# EAGLE design SolarRS485 (EAGLE 7.4.0)
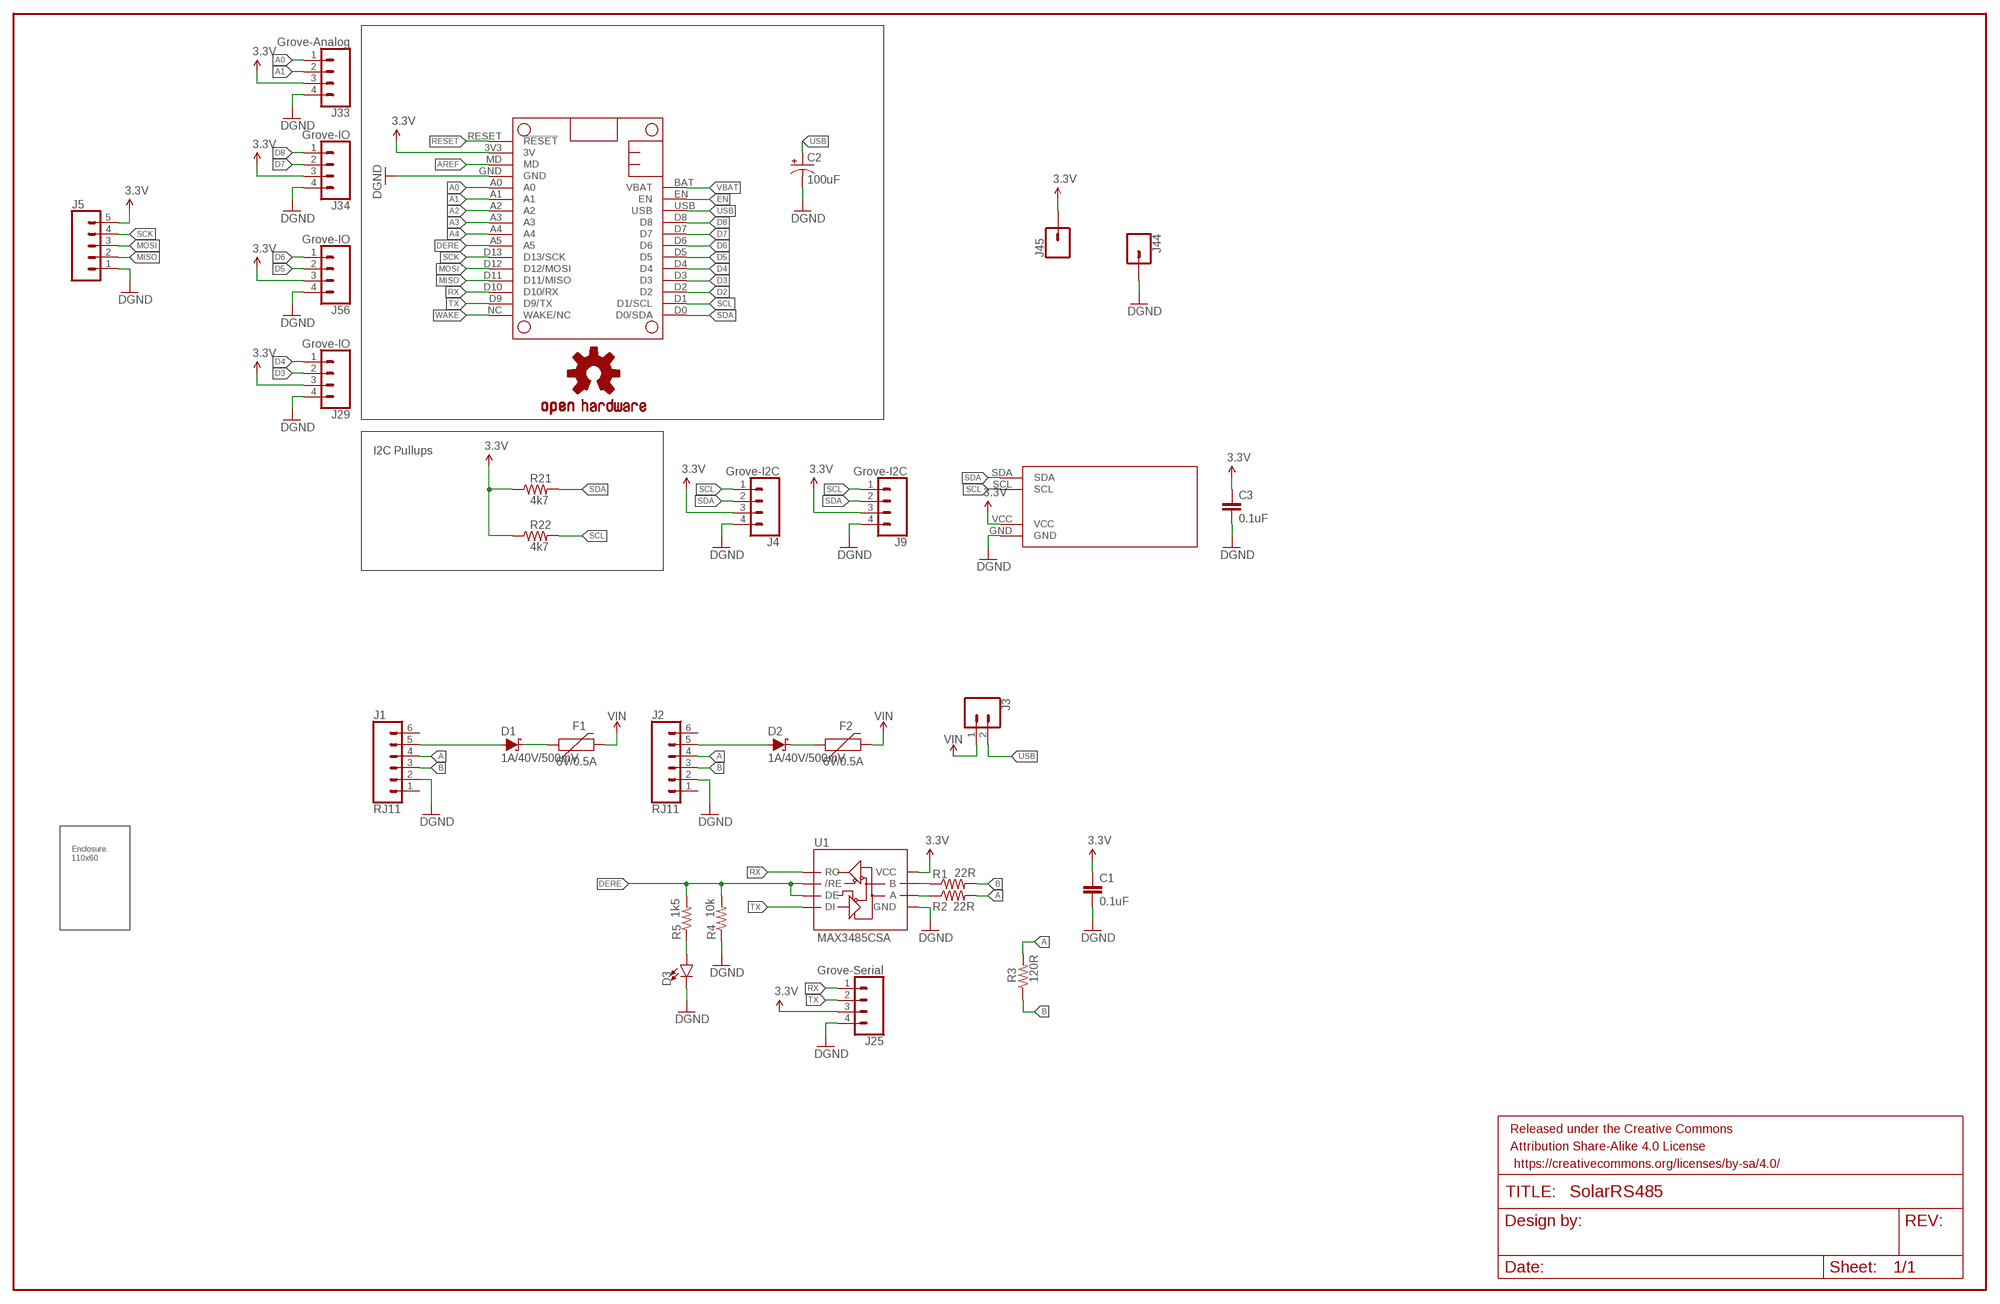
[diagram p0: schematic, sheet 1]

## Parts
C1  0.1uF  0.1UF-0805-25V  [0805]
C2  100uF  100UF-POLAR-RADIAL-2.5MM-25V-20%  [CPOL-RADIAL-2.5MM-6.5MM]
C3  0.1uF  0.1UF-0805-25V  [0805]
D1  1A/40V/500mV  DIODE-SCHOTTKY-SS14  [SMA-DIODE]
D2  1A/40V/500mV  DIODE-SCHOTTKY-SS14  [SMA-DIODE]
D3  LEDLED-1206-BOTTOM-2.0MM-BLUE  [LED-1206-BOTTOM-2.0MM]
F1  6V/0.5A  PPTC_HALF-AMP  [1206]
F2  6V/0.5A  PPTC_HALF-AMP  [1206]
FRAME2  FRAME-LEDGER  [CREATIVE_COMMONS]
J1  RJ11  RJ11-6  [RJ11-6]
J2  RJ11  RJ11-6  [RJ11-6]
J3  CONN_02  [1X02]
J4  Grove-I2C  CONN_04GROVE-JST-PH-4-2MM  [JST-4-PH-GROVE]
J5  CONN_05  [1X05]
J9  Grove-I2C  CONN_04GROVE-JST-PH-4-2MM  [JST-4-PH-GROVE]
J25  Grove-Serial  CONN_04GROVE-JST-PH-4-2MM  [JST-4-PH-GROVE]
J29  Grove-IO  CONN_04GROVE-JST-PH-4-2MM  [JST-4-PH-GROVE]
J33  Grove-Analog  CONN_04GROVE-JST-PH-4-2MM  [JST-4-PH-GROVE]
J34  Grove-IO  CONN_04GROVE-JST-PH-4-2MM  [JST-4-PH-GROVE]
J44  CONN_01PTH_NO_SILK_YES_STOP  [1X01_NO_SILK]
J45  CONN_01PTH_NO_SILK_YES_STOP  [1X01_NO_SILK]
J56  Grove-IO  CONN_04GROVE-JST-PH-4-2MM  [JST-4-PH-GROVE]
LOGO1  OSHW-LOGOM  [OSHW-LOGO-M]
MS1  XENONA  [XENON_BREAKOUT_A]
R1  22R  RESISTOR0805  [0805]
R2  22R  RESISTOR0805  [0805]
R3  120R  RESISTOR0805  [0805]
R4  10k  RESISTOR0805  [0805]
R5  1k5  RESISTOR0805  [0805]
R21  4k7  RESISTOR0805  [0805]
R22  4k7  RESISTOR0805  [0805]
U1  MAX3485CSA  RS485SOIC  [SO08]
U$1  CAMDENBOSS-ENCLOSURE-110X60BOTH-EXTENDED-WIDE  [CAMDENBOSS_ENCLOSURE_110X60_WIDE_EXTENDED]
U$2  DISPLAY0.96_INCH_DISPLAY  [I2C_DISPLAY_0.96_INCH]

## Nets
3.3V: C1.1 C3.1 J4.3 J5.5 J9.3 J25.3 J29.3 J33.3 J34.3 J45.1 J56.3 MS1.3V3(3V) R21.1 R22.1 U1.8(VCC) U$2.VCC
A: J1.4 J2.4 R2.2 R3.2
A0: J33.1 MS1.A0
A1: J33.2 MS1.A1
A2: MS1.A2
A3: MS1.A3
A4: MS1.A4
AREF: MS1.MD
B: J1.3 J2.3 R1.2 R3.1
D2: MS1.D2
D3: J29.2 MS1.D3
D4: J29.1 MS1.D4
D5: J56.2 MS1.D5
D6: J56.1 MS1.D6
D7: J34.2 MS1.D7
D8: J34.1 MS1.D8
DERE: MS1.A5 R4.2 R5.2 U1.2(/RE) U1.3(DE)
EN: MS1.EN
GND: C1.2 C2.2(-) C3.2 D3.C J1.2 J2.2 J4.4 J5.1 J9.4 J25.4 J29.4 J33.4 J34.4 J44.1 J56.4 MS1.GND R4.1 U1.5(GND) U$2.GND ; supply symbol labelled DGND
MISO: J5.2 MS1.D11(D11/MISO)
MOSI: J5.3 MS1.D12(D12/MOSI)
N$1: D2.A J2.5
N$3: D1.A J1.5
N$7: D2.C F2.1
N$11: D1.C F1.1
N$12: R1.1 U1.7(B)
N$13: R2.1 U1.6(A)
N$21: D3.A R5.1
RESET: MS1.RESET(!RESET)
RX: J25.1 MS1.D10(D10/RX) U1.1(RO)
SCK: J5.4 MS1.D13(D13/SCK)
SCL: J4.1 J9.1 MS1.D1(D1/SCL) R22.2 U$2.SCL
SDA: J4.2 J9.2 MS1.D0(D0/SDA) R21.2 U$2.SDA
TX: J25.2 MS1.D9(D9/TX) U1.4(DI)
USB: C2.1(+) J3.2 MS1.USB
VBAT: MS1.BAT(VBAT)
VIN: F1.2 F2.2 J3.1
WAKE: MS1.NC(WAKE/NC)
Unconnected: J1.1 J1.6 J2.1 J2.6

## Notes on the sheet
- I2C Pullups

## Library data of the parts
C1 C3 = ThingySticks:0.1UF: 0.1µF ceramic capacitors A capacitor is a passive two-terminal electrical component used to store electrical energy temporarily in an electric field.
C2 = SparkFun-Capacitors:100UF-POLAR: 100µF polarized capacitors A capacitor is a passive two-terminal electrical component used to store electrical energy temporarily in an electric field.; PROD_ID: CAP-08439
D1 D2 = SparkFun-DiscreteSemi:DIODE-SCHOTTKY: Schottky diode A Schottky diode is a semiconductor diode which has a low forward voltage drop and a very fast switching action.; PROD_ID: DIO-08053
D3 = ThingySticks:LED: LED (Generic) Standard schematic elements and footprints for 5mm, 3mm, 1206, and 0603 sized LEDs. Generic LEDs with no color specified.; COLOR: Blue; FARNELL: 2217907; FORWARD_VOLTAGE: 3.3
F1 F2 = SparkFun-Fuses:PPTC: Resettable Fuse PPTC Resettable Fuse. Really a sort of resistor with a polymeric positive temperature coefficient whose resistance increases dramatically with an increase in temperature. When heated by the power passing through the resistance rises causing the current to be limited, protecting the circuit. This is achieved by the transition of the polymer from a crystalline to an amorphous state where the conductive carbon separates breaking the conductive pathways found in the cool crystalline structure. When a PPTC cools back down it resumes conducting letting the circuit turn back on. SparkFun Products: SparkFun RedBoard - Programmed with Arduino <https://www.sparkfun.com/products/12757> Pro Micro - 5V/16MHz <https://www.sparkfun.com/products/12640> Arduino Pro 328 - 5V/16MHz <https://www.sparkfun.com/products/10915> MP3 Trigger <https://www.sparkfun.com/products/13720>; PROD_ID: RES-08585
FRAME2 = SparkFun-Aesthetics:FRAME-LEDGER: Schematic Frame Standard 11x14 US Ledger frame
J1 J2 = SparkFun-Connectors:RJ11-6: RJ11 Jack - 6 pin Commonly found on CAT3 devices and some Microchip programmers. Here is the connector we sell at SparkFun: RJ11 6-Pin Connector <https://www.sparkfun.com/products/132> (PRT-00132) Datasheet <http://www.sparkfun.com/datasheets/Prototyping/Connectors/RJ11-Datasheet.pdf> It is used on this SparkFun product: SparkFun Weather Shield <https://www.sparkfun.com/products/12081> (DEV-12081) Weather Meters <https://www.sparkfun.com/products/8942> (SEN-08942); PROD_ID: CONN-08590; SF_ID: PRT-00132
J3 = ThingySticks:CONN_02: Multi connection point. Often used as Generic Header-pin footprint for 0.1 inch spaced/style header connections On any of the 0.1 inch spaced packages, you can populate with these: Break Away Headers - Straight <https://www.sparkfun.com/products/116> (PRT-00116) Break Away Male Headers - Right Angle <https://www.sparkfun.com/products/553> (PRT-00553) Female Headers <https://www.sparkfun.com/products/115> (PRT-00115) Break Away Headers - Machine Pin <https://www.sparkfun.com/products/117> (PRT-00117) Break Away Female Headers - Swiss Machine Pin <https://www.sparkfun.com/products/743> (PRT-00743) For SCREWTERMINALS and SPRING TERMINALS visit here: Screw Terimnals on SparkFun.com <https://www.sparkfun.com/search/results?term=Screw+Terminals> (5mm/3.5mm/2.54mm spacing) This device is also useful as a general connection point to wire up your design to another part of your project. Our various solder wires solder well into these plated through hole pads. Hook-Up Wire - Assortment (Stranded, 22 AWG) <https://www.sparkfun.com/products/11375> (PRT-11375) Hook-Up Wire - Assortment (Solid Core, 22 AWG) <https://www.sparkfun.com/products/11367> (PRT-11367) View the entire wire category on our website here <https://www.sparkfun.com/categories/141> Special notes: Molex polarized connector foot print use with: PRT-08233 with associated crimp pins and housings. 2.54_SCREWTERM for use with PRT-10571. 3.5mm Screw Terminal footprints for PRT-08084 5mm Screw Terminal footprints for use with PRT-08432
J4 J9 J25 J29 J33 J34 J56 = ThingySticks:CONN_04: Multi connection point. Often used as Generic Header-pin footprint for 0.1 inch spaced/style header connections On any of the 0.1 inch spaced packages, you can populate with these: Break Away Headers - Straight <https://www.sparkfun.com/products/116> (PRT-00116) Break Away Male Headers - Right Angle <https://www.sparkfun.com/products/553> (PRT-00553) Female Headers <https://www.sparkfun.com/products/115> (PRT-00115) Break Away Headers - Machine Pin <https://www.sparkfun.com/products/117> (PRT-00117) Break Away Female Headers - Swiss Machine Pin <https://www.sparkfun.com/products/743> (PRT-00743) For SCREWTERMINALS and SPRING TERMINALS visit here: Screw Terimnals on SparkFun.com <https://www.sparkfun.com/search/results?term=Screw+Terminals> (5mm/3.5mm/2.54mm spacing) This device is also useful as a general connection point to wire up your design to another part of your project. Our various solder wires solder well into these plated through hole pads. Hook-Up Wire - Assortment (Stranded, 22 AWG) <https://www.sparkfun.com/products/11375> (PRT-11375) Hook-Up Wire - Assortment (Solid Core, 22 AWG) <https://www.sparkfun.com/products/11367> (PRT-11367) View the entire wire category on our website here <https://www.sparkfun.com/categories/141> Special notes: Molex polarized connector foot print use with SKU : PRT-08231 with associated crimp pins and housings. 1MM SMD Version SKU: PRT-10208
J5 = SparkFun-Connectors:CONN_05: Multi connection point. Often used as Generic Header-pin footprint for 0.1 inch spaced/style header connections On any of the 0.1 inch spaced packages, you can populate with these: Break Away Headers - Straight <https://www.sparkfun.com/products/116> (PRT-00116) Break Away Male Headers - Right Angle <https://www.sparkfun.com/products/553> (PRT-00553) Female Headers <https://www.sparkfun.com/products/115> (PRT-00115) Break Away Headers - Machine Pin <https://www.sparkfun.com/products/117> (PRT-00117) Break Away Female Headers - Swiss Machine Pin <https://www.sparkfun.com/products/743> (PRT-00743) For SCREWTERMINALS and SPRING TERMINALS visit here: Screw Terimnals on SparkFun.com <https://www.sparkfun.com/search/results?term=Screw+Terminals> (5mm/3.5mm/2.54mm spacing) This device is also useful as a general connection point to wire up your design to another part of your project. Our various solder wires solder well into these plated through hole pads. Hook-Up Wire - Assortment (Stranded, 22 AWG) <https://www.sparkfun.com/products/11375> (PRT-11375) Hook-Up Wire - Assortment (Solid Core, 22 AWG) <https://www.sparkfun.com/products/11367> (PRT-11367) View the entire wire category on our website here <https://www.sparkfun.com/categories/141> Special notes: Molex polarized connector foot print use with SKU : PRT-08231 with associated crimp pins and housings. 1MM SMD Version SKU: PRT-10208
J44 J45 = SparkFun-Connectors:CONN_01: Single connection point. Often used as Generic Header-pin footprint for 0.1 inch spaced/style header connections On any of the 0.1 inch spaced packages, you can populate with these: Break Away Headers - Straight <https://www.sparkfun.com/products/116> (PRT-00116) Break Away Male Headers - Right Angle <https://www.sparkfun.com/products/553> (PRT-00553) Female Headers <https://www.sparkfun.com/products/115> (PRT-00115) Break Away Headers - Machine Pin <https://www.sparkfun.com/products/117> (PRT-00117) Break Away Female Headers - Swiss Machine Pin <https://www.sparkfun.com/products/743> (PRT-00743) This device is also useful as a general connection point to wire up your design to another part of your project. Our various solder wires solder well into these plated through hole pads. Hook-Up Wire - Assortment (Stranded, 22 AWG) <https://www.sparkfun.com/products/11375> (PRT-11375) Hook-Up Wire - Assortment (Solid Core, 22 AWG) <https://www.sparkfun.com/products/11367> (PRT-11367) View the entire wire category on our website here <https://www.sparkfun.com/categories/141> Special notes: SMTSO-256-ET is a "flush mount" nut for a 4-40 screw. We mostly use this on specialty testbeds; it is a nice way to connect hardware to your PCB at an adjustable hieght. Also note, the SNAP packages are for using a snappable style connector. We sell a baggie of snaps and they are also used on two LilyPad designs: Snap Assortment - 30 pack (male and female) <https://www.sparkfun.com/products/11347> (DEV-11347) LilyPad Arduino SimpleSnap <https://www.sparkfun.com/products/10941> (DEV-10941) LilyPad SimpleSnap Protoboard <https://www.sparkfun.com/products/10940> (DEV-10940)
LOGO1 = SparkFun-Aesthetics:OSHW-LOGO: Open Source Hardware Logo This logo indicates the piece of hardware it is found on incorporates a OSHW license and/or adheres to the definition of open source hardware found here: http://freedomdefined.org/OSHW
MS1 = ThingySticks:XENON
R1-R5 R21 R22 = SparkFun-Resistors:RESISTOR: Generic Resistor Package
U1 = SparkFun-IC-Comms:RS485: RS-485 Transceiver SP3485 Series 8 Pin NSOIC 3.3 V Low Power Half Duplex RS-485 Transceiver MAX3485 compatible Datasheet <http://www.sparkfun.com/datasheets/Components/General/sp3485CN-LTR.pdf> SparkFun Products SparkFun Transceiver Breakout - RS-485 <https://www.sparkfun.com/products/10124> (BOB-10124) SparkFun USB to RS-485 Converter <https://www.sparkfun.com/products/9822> (BOB-09822); PROD_ID: IC-09388
U$1 = ThingySticks:CAMDENBOSS-ENCLOSURE-110X60
U$2 = ThingySticks:DISPLAY

## Board
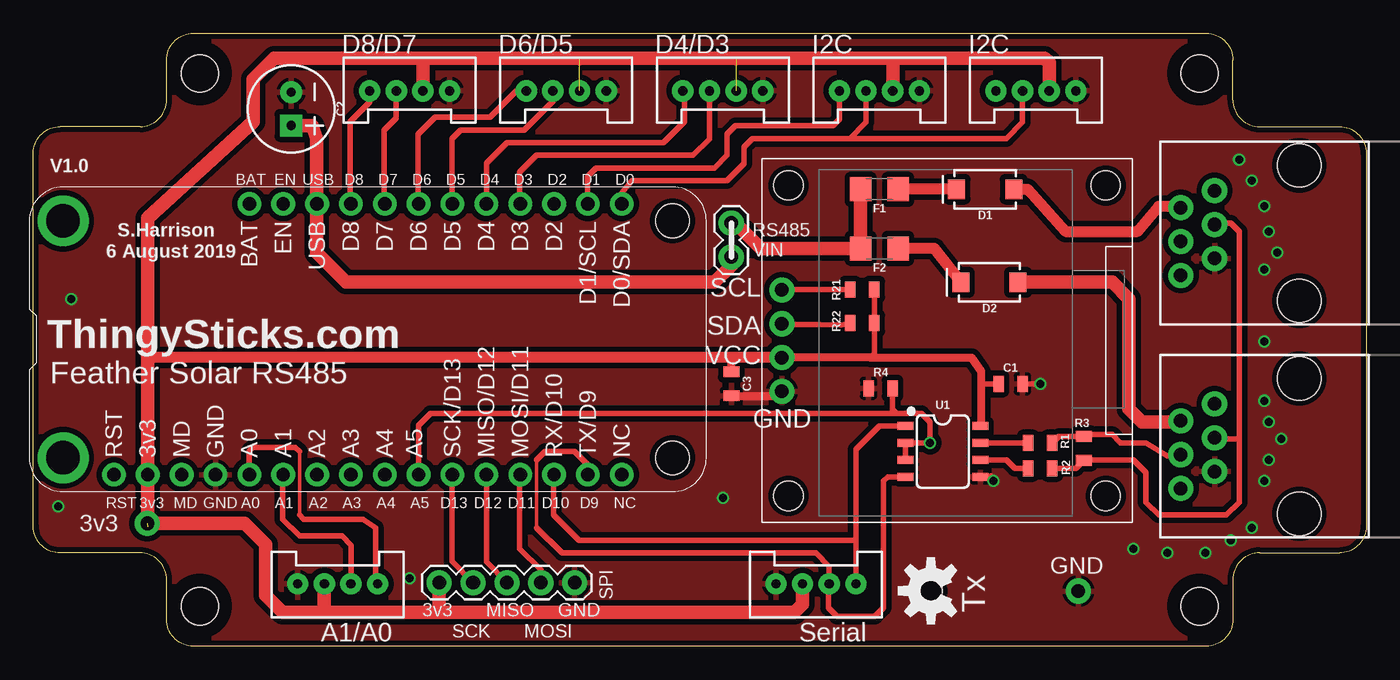
[diagram p1: board, top side]
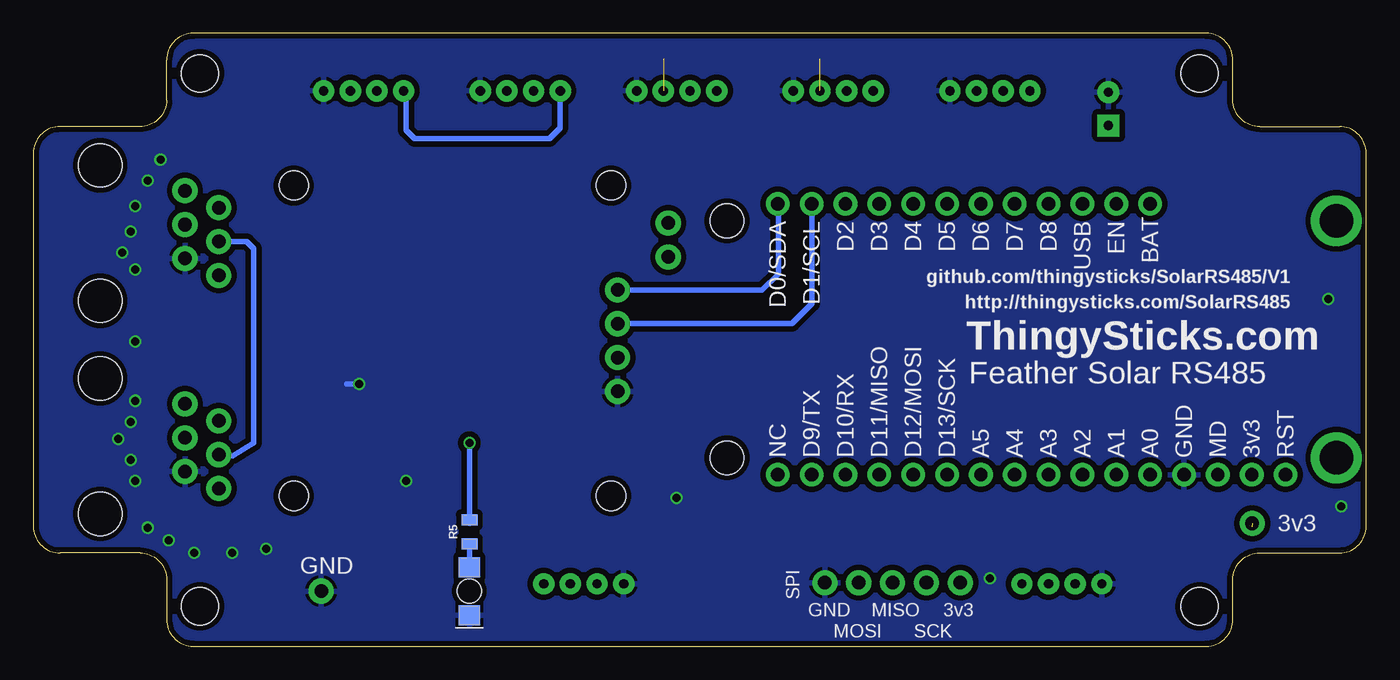
[diagram p2: board, bottom side, seen from below]

Size 100 x 46 mm. Coordinates in mm from the lower left corner, seen from the top.
Copper layers (1*16): Top 0.035mm / dielectric 1.5mm / Bottom 0.035mm
Design rules "dirt_cheap_dirty_boards.v1.1": minimum track width 6mil, minimum drill 12mil, track to track 6mil, track to pad 6mil, pad to pad 6mil, via to via 6mil, smd to smd 0mil, copper to edge 10mil, drill to drill 10mil, minimum pad ring 10mil, minimum via ring 6mil, stop-mask expansion 2mil, vias tented up to drill 25mil, thermal gap 10mil
tRestrict: area 10.5,41 to 14.5,45; area 10.5,1 to 14.5,5; area 85.5,1 to 89.5,5; area 85.5,41 to 89.5,45

### Footprints (pad centres in the part's own frame; a part is rotated, then mirrored left to right if it is on the bottom)
0805 = smd 0.8 x 1.2: 1 -0.9,0; 2 0.9,0
CPOL-RADIAL-2.5MM-6.5MM = drill 0.7 pad 1.651 square: 1 1.25,0 | drill 0.7 pad 1.651: 2 -1.25,0
SMA-DIODE = smd 1.27 x 1.47: A -2.15,0; C 2.15,0
LED-1206-BOTTOM-2.0MM = smd 1.5 x 1.6: A -1.8,0; C 1.8,0 | hole 1.8: 0,0
1206 = smd 1.6 x 1.8: 1 -1.4,0; 2 1.4,0
RJ11-6 = drill 1.016 pad 1.88: 1 -3.175,8.89; 2 -1.905,6.35; 3 -0.635,8.89; 4 0.635,6.35; 5 1.905,8.89; 6 3.175,6.35 | hole 3.251: -5.08,0; 5.08,0
1X02 = drill 1.016 pad 1.88: 1 0,0; 2 2.54,0
JST-4-PH-GROVE = drill 0.7 pad 1.6: 1 -3,-0.55; 2 -1,-0.55; 3 1,-0.55; 4 3,-0.55
1X05 = drill 1.016 pad 1.88: 1 0,0; 2 2.54,0; 3 5.08,0; 4 7.62,0; 5 10.16,0
1X01_NO_SILK = drill 1.016 pad 1.88: 1 0,0
XENON_BREAKOUT_A = drill 1 pad 1.778: 3V3 8.89,1.27; A0 16.51,1.27; A1 19.05,1.27; A2 21.59,1.27; A3 24.13,1.27; A4 26.67,1.27; A5 29.21,1.27; BAT 16.51,21.59; D0 44.45,21.59; D1 41.91,21.59; D2 39.37,21.59; D3 36.83,21.59; D4 34.29,21.59; D5 31.75,21.59; D6 29.21,21.59; D7 26.67,21.59; D8 24.13,21.59; D9 41.91,1.27; D10 39.37,1.27; D11 36.83,1.27; D12 34.29,1.27; D13 31.75,1.27; EN 19.05,21.59; GND 13.97,1.27; MD 11.43,1.27; NC 44.45,1.27; RESET 6.35,1.27; USB 21.59,21.59 | drill 2.5 pad 3.81: P$1 2.54,20.32; P$2 2.54,2.54 | hole 2.54: 48.26,20.32; 48.26,2.54
SO08 = smd 0.6 x 1.2: 1 -1.905,-2.8; 2 -0.635,-2.8; 3 0.635,-2.8; 4 1.905,-2.8; 5 1.905,2.8; 6 0.635,2.8; 7 -0.635,2.8; 8 -1.905,2.8
CAMDENBOSS_ENCLOSURE_110X60_WIDE_EXTENDED = hole 2.8: 43,2.5; 43,77.5; 3,77.5; 3,2.5
I2C_DISPLAY_0.96_INCH = drill 1.016 pad 1.88: GND 9.84,26.3; SCL 14.92,26.3; SDA 17.46,26.3; VCC 12.38,26.3 | hole 2.2: 2,25.8; 25.3,25.8; 2,2; 25.3,2

### Placement (x,y rotation side)
C1  73.32,19.7 0 top
C2  19.34,40.33 270 top
C3  52.36,19.7 270 top
D1  71.41,34.3 180 top
D2  71.73,27.32 180 top
D3  67.28,4.14 270 bottom
F1  63.47,34.3 180 top
F2  63.47,29.86 180 top
FRAME2  16.52,-14.12 0 top  (outside the outline)
J1  94.97,31.01 90 top
J2  94.97,15.01 90 top
J3  52.36,31.76 270 top
J4  63.47,42.24 0 top
J5  40.61,4.77 180 top
J9  75.22,42.24 0 top
J25  58.71,4.14 180 top
J29  51.73,42.24 0 top
J33  22.83,4.14 180 top
J34  28.23,42.24 0 top
J44  78.4,4.14 0 top
J45  8.55,9.22 0 top
J56  39.98,42.24 0 top
LOGO1  67.34,4.16 90 top
MS1  -0.3,11.6 0 top
R1  75.54,15.25 0 top
R2  75.54,13.35 0 top
R3  78.83,14.84 270 top
R4  63.56,19.35 0 top
R5  67.28,8.58 90 bottom
R21  62.19,26.77 180 top
R22  62.19,24.25 180 top
U1  68.24,14.62 270 top
U$1  90,0 90 top
U$2  82.46,9.28 90 top

### Tracks (layer width: path | path; a pad name or v marks a point on that pad's centre or on a via)
3.3V  (3 unrouted)
  Top 0.406: R21.1 R22.1 63.09,21.91 62.84,21.66 | C1.1 71.09,19.7
  Top 0.61: U1.8 71.09,16.58 71.09,19.7 71.09,20.65 70.4,21.66 62.84,21.66 U$2.VCC | C3.1 52.36,21.66
  Top 0.813: U$2.VCC 52.36,21.66 8.84,21.66 8.59,21.92
  Top 1.016: 8.59,8.94 MS1.3V3 8.59,21.92 8.59,32.12 16.48,39.38 16.48,42.55 18.07,44.14 29.5,44.14 | J9.3 76.22,43.78 75.86,44.14 64.43,44.14 | 64.43,44.14 52.68,44.14 | 52.68,44.14 40.93,44.14 | 40.93,44.14 29.5,44.14 | J34.3 29.23,43.87 29.5,44.14 | 40.98,44.09 40.93,44.14 | 52.73,44.09 52.68,44.14 | J4.3 64.47,44.09 64.43,44.14 | J25.3 57.71,3.14 57.12,2.55 30.45,2.55 | 30.45,2.55 21.88,2.55 | 21.88,2.55 18.71,2.55 17.44,3.82 17.44,7.63 15.85,9.22 J45.1 | J33.3 21.83,2.6 21.88,2.55 | J5.5 30.45,2.55
A
  Top 0.406: 90.46,15.57 90.46,31.12 89.83,31.76 88.74,31.76 J1.4 | 90.46,15.57 88.68,15.57 J2.4 | 90.46,15.57 90.46,10.8 89.51,9.85 84.43,9.85 83.48,10.8 83.48,13.03 82.52,13.98 78.87,13.98 R3.2 78.23,13.35 R2.2
A0
  Top 0.254: 19.98,14.62 19.98,9.85
  Top 0.406: MS1.A0 16.21,14.65 16.48,14.93 19.66,14.93 19.98,14.62 | 19.98,9.85 20.29,9.54 24.74,9.54 25.69,8.9 25.69,4.19 J33.1
A1
  Top 0.406: J33.2 23.83,7.58 23.15,8.27 19.98,8.27 18.71,9.54 18.71,12.83 MS1.A1
AREF
  Bottom 0.61: 11.09,12.83 MS1.MD
B
  Top 0.406: J2.3 85.67,14.3 85.06,14.3 83.48,15.25 81.57,15.25 80.94,15.88 78.97,15.88 R3.1 76.93,15.74 R1.2
  Bottom 0.406: J1.3 84,30.38 83.48,29.86 83.48,15.25 85.03,14.3 J2.3
D3
  Top 0.406: J29.2 50.73,38.06 49.5,36.84 37.76,36.84 36.49,35.57 36.49,33.23 MS1.D3
D4
  Top 0.406: MS1.D4 33.99,36.24 35.53,37.79 47.28,37.79 48.87,39.38 48.87,41.54 J29.1
D5
  Top 0.406: J56.2 38.98,40.92 36.8,38.74 32.04,38.74 31.41,38.11 31.41,33.23 MS1.D5
D6
  Top 0.406: J56.1 36.25,41.69 34.26,39.7 30.14,39.7 28.87,38.43 28.87,33.23 MS1.D6
D7
  Top 0.406: J34.2 27.23,39.65 26.33,38.74 26.33,33.23 MS1.D7
D8
  Top 0.406: J34.1 25.23,40.82 23.79,39.38 23.79,33.23 MS1.D8
DERE  (via drill 0.6)
  Top 0.406: U1.3 U1.2 v67.28,15.25 67.28,16.84 66.65,17.47 64.74,17.47 | MS1.A5 28.91,16.56 29.82,17.47 64.74,17.47 | R4.2 64.46,17.75 64.74,17.47
  Bottom 0.406: 67.28,9.22 R5.2 v67.28,15.25
GND  (via drill 0.6)
  Top 0.406: C1.2 v75.54,19.7 | U1.5 71.85,12.77 v72.05,12.39
  Top 0.61: C3.2 55.84,18.8 U$2.GND
  Bottom 0.406: v75.54,19.7 76.49,19.7
  other vias: 2.83,26.05 1.88,10.49 51.73,11.12 92.68,16.84 93.64,15.57 92.68,13.98 92.37,12.39 92.37,28.27 93.32,29.54 92.68,31.12 92.37,33.03 91.41,34.93 90.46,36.52 92.37,18.43 92.37,22.87 91.41,8.9 89.83,7.95 87.92,7 85.06,7 82.52,7.31 28.23,5.09
  pour Bottom (isolate 0.406, rank 5): -0.66,46.36 101.26,46.36 101.26,-1.26 -0.66,-1.26
  pour Top (isolate 0.406, rank 5): -0.66,46.68 100.62,46.68 100.62,-0.94 -4.15,-0.94 -4.15,46.68 -2.25,46.68
MISO
  Top 0.406: J5.2 38.07,5.72 36.49,7.31 36.49,12.83 MS1.D11
MOSI
  Top 0.406: MS1.D12 33.99,6.32 J5.3
N$1
  Top 1.016: D2.A 80.94,27.32 82.21,26.05 82.21,17.79 83.16,16.84 85.19,16.84 J2.5
N$3
  Top 0.813: D1.A 74.59,34.3 77.44,31.12 82.84,31.12 84.43,33.03 85.63,33.03 J1.5
N$7
  Top 0.813: D2.C 67.6,29.86 F2.1
N$11
  Top 0.813: D1.C F1.1
N$12
  Top 0.406: U1.7 R1.1
N$13
  Top 0.406: U1.6 73,13.98 73.63,13.35 R2.1
N$21
  Bottom 0.406: D3.A R5.1
RX
  Top 0.406: U1.1 63.47,16.52 61.71,14.76 61.71,7.95 | 61.71,7.95 40.93,7.95 39.03,9.85 39.03,12.83 MS1.D10 | J25.1 61.71,7.95
SCK
  Top 0.406: J5.4 31.41,6.36 31.41,12.83 MS1.D13
SCL
  Top 0.406: R22.2 60.58,24.1 59.03,24.14 56.22,24.14 U$2.SCL | J4.1 60.47,39.55 59.98,39.06 52.68,39.06 52.04,38.43 52.04,36.84 51.09,35.89 42.2,35.89 41.57,35.25 41.57,33.23 MS1.D1
  Bottom 0.406: U$2.SCL 43.09,24.2 41.57,25.73 41.57,33.15 MS1.D1 | J4.1 60.47,38.89 61.25,38.11 71.41,38.11 72.05,38.74 72.05,41.51 J9.1
SDA
  Top 0.406: R21.2 56.19,26.77 U$2.SDA | J4.2 62.47,39.33 61.25,38.11 | 61.25,38.11 60.62,38.11 53.95,38.11 53.31,37.48 53.31,36.2 52.04,34.93 44.94,34.93 44.11,33.98 44.11,33.19 MS1.D0 | J9.2 74.22,39.33 73,38.11 61.25,38.11
  Bottom 0.406: MS1.D0 44.11,33.15 44.11,27.95 45.32,26.74 U$2.SDA
TX
  Top 0.254: 37.76,8.9 37.76,13.98
  Top 0.406: U1.4 64.11,12.71 63.79,12.39 63.79,2.87 63.16,2.23 60.3,2.23 59.66,2.87 59.66,4 J25.2 59.71,6 58.71,7 39.66,7 37.76,8.9 | 37.76,13.98 38.39,14.62 40.61,14.62 41.57,13.66 41.57,12.91 MS1.D9
USB
  Top 1.016: C2.1 20.91,39.08 21.25,38.11 21.25,33.23 MS1.USB 21.25,33.15 21.25,29.54 23.47,27.32 51.09,27.32 52.36,28.59 J3.2
VIN
  Top 1.016: J3.1 52.68,31.76 54.58,29.86 F2.2 F1.2

### Text on the board
tNames: D8/D7 | D6/D5 | D4/D3 | I2C | I2C | V1.0 | S.Harrison | 6 August 2019 | RS485 / VIN | SCL | SDA | VCC | ThingySticks.com | Feather Solar RS485 | GND | 3v3 | GND | SPI | Tx | 3v3 | MISO | GND | SCK | MOSI | A1/A0 | Serial
bNames: github.com/thingysticks/SolarRS485/V1 | http://thingysticks.com/SolarRS485 | ThingySticks.com | Feather Solar RS485 | 3v3 | GND | SPI | 3v3 | MISO | GND | SCK | MOSI